# EAGLE design SolenoidBoard (EAGLE 7.4.0)
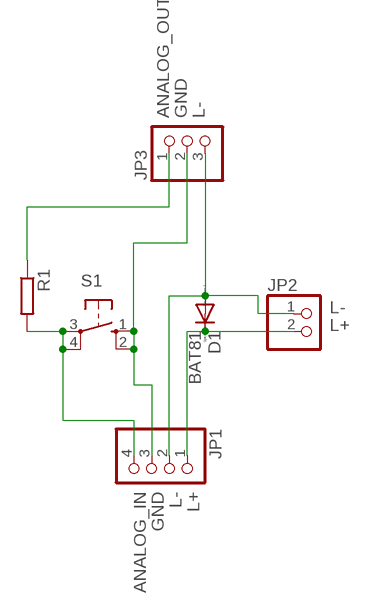
[diagram p0: schematic, sheet 1]

## Parts
D1  BAT81  [DO34-7]
JP1  PINHD-1X4  [1X04]
JP2  PINHD-1X2  [1X02]
JP3  PINHD-1X3  [1X03]
R1  R-EU_0204/7  [0204/7]
S1  10-XX  [B3F-10XX]

## Nets
ANALOG_IN: JP1.4 R1.2 S1.3(P) S1.4(P1)
ANALOG_OUT: JP3.1 R1.1
GND: JP1.3 JP3.2 S1.1(S) S1.2(S1)
L+: D1.C JP1.1 JP2.2
L-: D1.A JP1.2 JP2.1 JP3.3

## Library data of the parts
D1 = diode:BAT81: DIODE barrier diode
JP1 = pinhead:PINHD-1X4: PIN HEADER
JP2 = pinhead:PINHD-1X2: PIN HEADER
JP3 = pinhead:PINHD-1X3: PIN HEADER
R1 = resistor:R-EU_: RESISTOR, European symbol
S1 = switch-omron:10-XX: OMRON SWITCH; MPN: B3F-1000; OC_FARNELL: 176432; OC_NEWARK: 36M3542

## Board
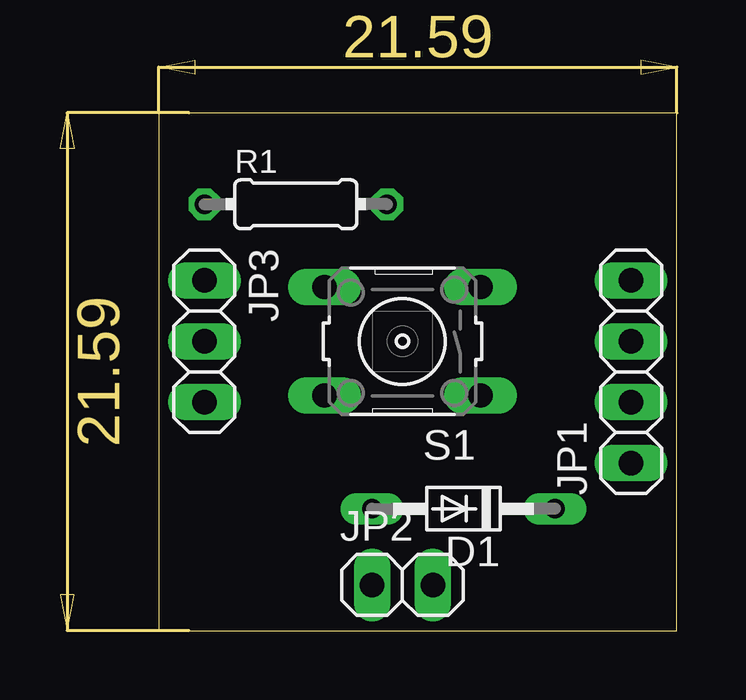
[diagram p1: board, top side]
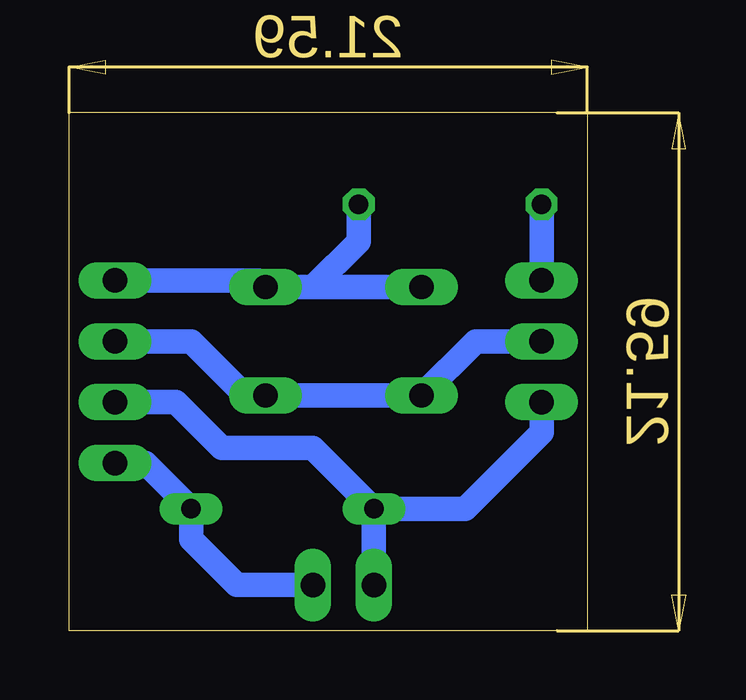
[diagram p2: board, bottom side, seen from below]

Size 21.59 x 21.59 mm. Coordinates in mm from the lower left corner, seen from the top.
Outline: 0,21.59 0,0 21.59,0 21.59,21.59 0,21.59
Copper layers (1*16): Top 0.035mm / dielectric 1.5mm / Bottom 0.035mm
Design rules "default": minimum track width 10mil, minimum drill 24mil, track to track 8mil, track to pad 8mil, pad to pad 8mil, via to via 8mil, smd to smd 8mil, copper to edge 40mil, drill to drill 8mil, minimum pad ring 10mil, minimum via ring 8mil, stop-mask expansion 4mil, vias tented up to drill 0mil, thermal gap 10mil

### Footprints (pad centres in the part's own frame; a part is rotated, then mirrored left to right if it is on the bottom)
DO34-7 = drill 0.813 long: A 3.81,0; C -3.81,0
1X04 = drill 1.016 long: 1 -3.81,0; 2 -1.27,0; 3 1.27,0; 4 3.81,0
1X02 = drill 1.016 long: 1 -1.27,0; 2 1.27,0
1X03 = drill 1.016 long: 1 -2.54,0; 2 0,0; 3 2.54,0
0204/7 = drill 0.813 octagon: 1 -3.81,0; 2 3.81,0
B3F-10XX = drill 1.016 long: 1 -3.251,2.261; 2 3.251,2.261; 3 -3.251,-2.261; 4 3.251,-2.261

### Placement (x,y rotation side)
D1  12.7,5.08 180 top
JP1  19.69,10.8 90 top
JP2  10.16,1.91 0 top
JP3  1.9,12.07 270 top
R1  5.71,17.78 0 top
S1  10.16,12.07 180 top

### Tracks (layer width: path | path; a pad name or v marks a point on that pad's centre or on a via)
ANALOG_IN
  Bottom 1.016: JP1.4 13.69,14.61 S1.3 11.43,14.33 | 11.43,14.33 S1.4 | R1.2 9.53,16.23 11.43,14.33
ANALOG_OUT
  Bottom 1.016: JP3.1 R1.1
GND
  Bottom 1.016: JP3.2 4.65,12.07 S1.2 S1.1 14.25,9.8 16.51,12.07 JP1.3
L+
  Bottom 1.016: JP1.1 18.41,6.98 D1.C 16.51,3.81 14.6,1.91 JP2.2
L-
  Bottom 1.016: JP1.2 17.14,9.52 15.24,7.62 11.43,7.62 D1.A | JP3.3 1.9,8.26 5.08,5.08 D1.A | D1.A JP2.1